# Altium project Drone Flight Controller.PrjPcb
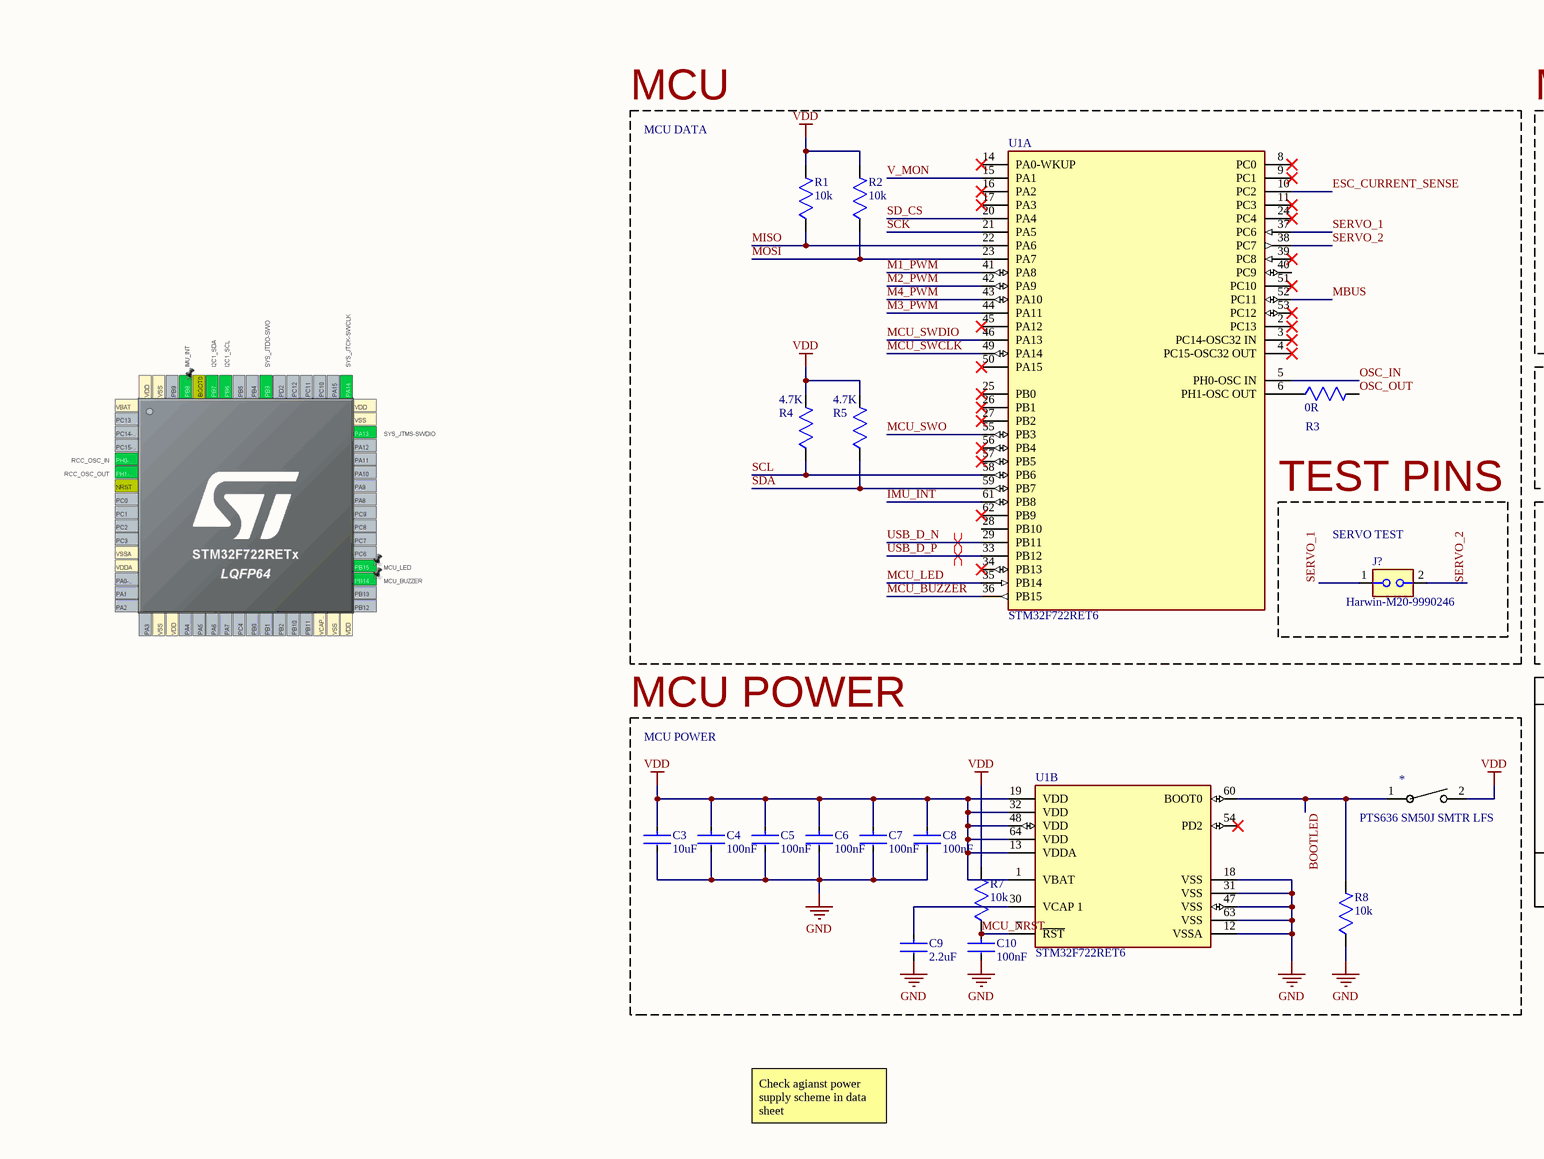
[diagram p0: MCU.SchDoc, left]
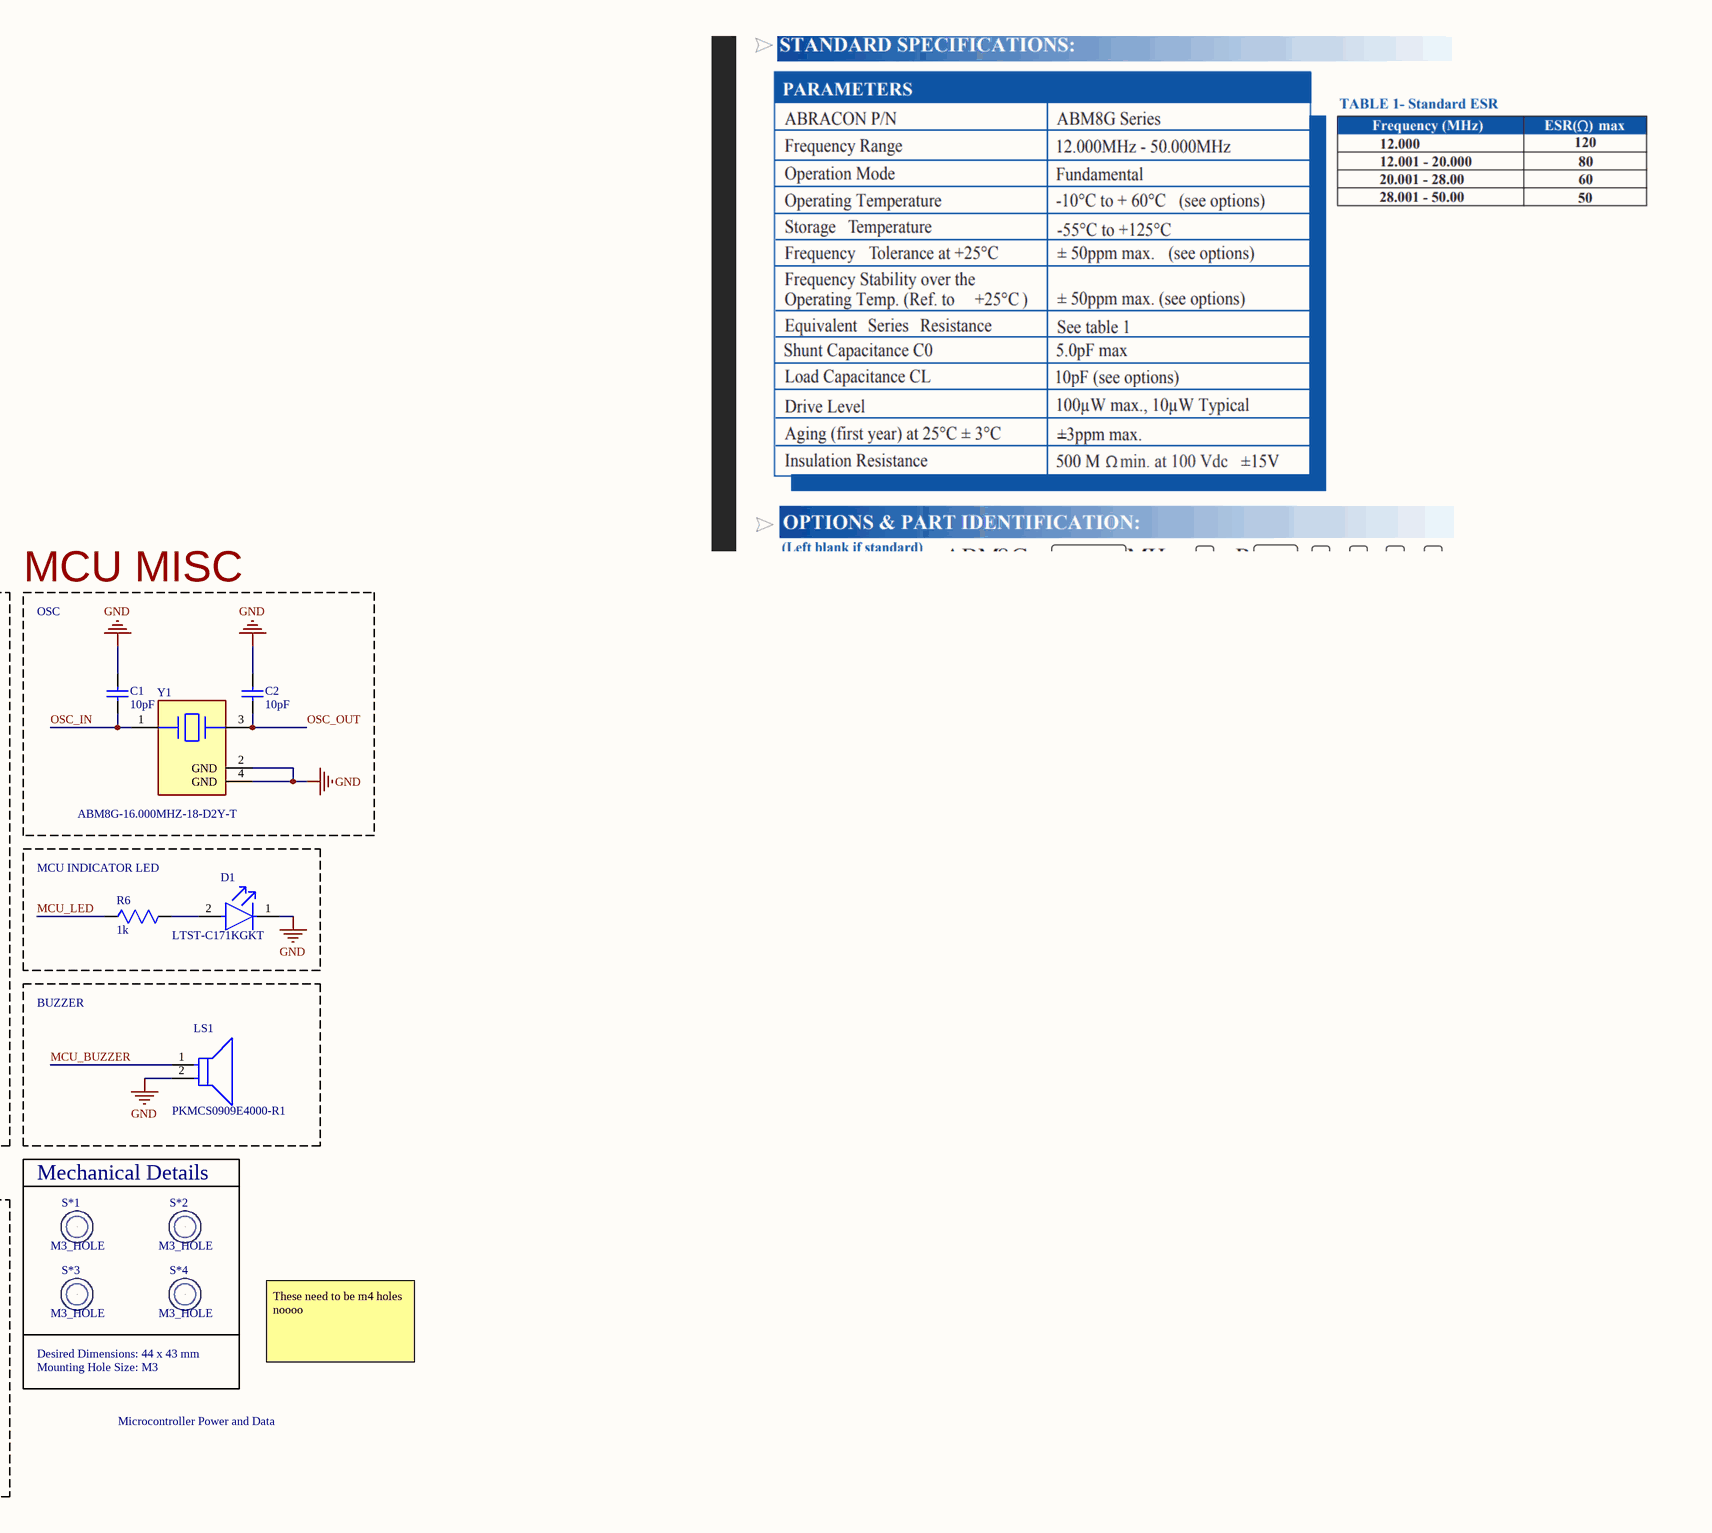
[diagram p1: MCU.SchDoc, right]
4 sheets, 63 parts. Net scope: global (net labels, ports and power ports of the same name join across sheets).
Board files: PCB1.PcbDoc, PCB Rev 2.PcbDoc
Sheets:
  MCU.SchDoc
  Sensors.SchDoc
  Power.SchDoc
  Connectors.SchDoc

## Sheet MCU.SchDoc
size A4; SheetNumber: 1; SheetTotal: 4

### Parts
*1  PTS636 SM50J SMTR LFS  [PTS636 SM50J SMTR LFS-Footprint-1]
C1  10pF  [CAPC1005X55X25ML05T05]
C2  10pF  [CAPC1005X55X25ML05T05]
C3  10uF  [CAP_1210]
C4  100nF  [CAP_0603]
C5  100nF  [CAP_0603]
C6  100nF  [CAP_0603]
C7  100nF  [CAP_0603]
C8  100nF  [CAP_0603]
C9  2.2uF  [CAP_1210]
C10  100nF  [CAP_0603]
D1  LTST-C171KGKT  [FP-LTST-C171KGKT-MFG]
J?5  Harwin-M20-9990246  [HARWIN_M20-9990246]
LS1  PKMCS0909E4000-R1  [FP-PKMCS-MFG]
R1  10k  [RES_0603]
R2  10k  [RES_0603]
R3  0R  [RES_0603]
R4  4.7K  [RES_0603]
R5  4.7K  [RES_0603]
R6  1k  [RES_0603]
R7  10k  [RES_0603]
R8  10k  [RES_0603]
S*1  M3_HOLE  [M3 Screw Hole Footprint]
S*2  M3_HOLE  [M3 Screw Hole Footprint]
S*3  M3_HOLE  [M3 Screw Hole Footprint]
S*4  M3_HOLE  [M3 Screw Hole Footprint]
U1  STM32F722RET6  [FP-LQFP64-5W-IPC_A]  (parts A,B of 2)
Y1  ABM8G-16.000MHZ-18-D2Y-T  [FP-ABM8G-MFG]

### Blocks framed on the sheet
MCU: R1-R5 U1
MCU MISC: C1 C2 Y1
MCU INDICATOR LED: D1 R6
TEST PINS: J?5
BUZZER: LS1
MCU POWER: *1 C3-C10 R7 R8 U1

### Nets
GND: C1.2 C2.2 C3.2 C4.2 C5.2 C6.2 C7.2 C8.2 C9.2 C10.2 D1.1(C) LS1.2(A) R8.1 U1.12(VSSA) U1.18(VSS) U1.31(VSS) U1.47(VSS) U1.63(VSS) Y1.2(GND) Y1.4(GND)
SCL: R4.1 U1.58(PB6)
SDA: R5.1 U1.59(PB7)
VDD: *1.2 C3.1 C4.1 C5.1 C6.1 C7.1 C8.1 R1.2 R2.2 R4.2 R5.2 R7.2 U1.1(VBAT) U1.13(VDDA) U1.19(VDD) U1.32(VDD) U1.48(VDD) U1.64(VDD)
BOOTLED: *1.1 R8.2 U1.60(BOOT0)
ESC_CURRENT_SENSE: U1.10(PC2)
IMU_INT: U1.61(PB8)
M1_PWM: U1.41(PA8)
M2_PWM: U1.42(PA9)
M3_PWM: U1.44(PA11)
M4_PWM: U1.43(PA10)
MBUS: U1.52(PC11)
MCU_BUZZER: LS1.1(C) U1.36(PB15)
MCU_LED: R6.1 U1.35(PB14)
MCU_NRST: C10.1 R7.1 U1.7(~{RST})
MCU_SWCLK: U1.49(PA14)
MCU_SWDIO: U1.46(PA13)
MCU_SWO: U1.55(PB3)
MISO: R1.1 U1.22(PA6)
MOSI: R2.1 U1.23(PA7)
OSC_IN: C1.1 U1.5(PH0-OSC_IN) Y1.1
OSC_OUT: C2.1 R3.2 Y1.3
SCK: U1.21(PA5)
SD_CS: U1.20(PA4)
SERVO_1: J?5.1 U1.37(PC6)
SERVO_2: J?5.2 U1.38(PC7)
USB_D_N: U1.29(PB11)
USB_D_P: U1.33(PB12)
V_MON: U1.15(PA1)
NetC9_1: C9.1 U1.30(VCAP_1)
NetD1_2: D1.2(A) R6.2
NetR3_1: R3.1 U1.6(PH1-OSC_OUT)

Not connected (* = marked no-connect by the designer): S*1 0; S*2 0; S*3 0; S*4 0; U1 2(PC13)* 3(PC14-OSC32_IN)* 4(PC15-OSC32_OUT)* 8(PC0)* 9(PC1)* 11(PC3)* 14(PA0-WKUP)* 16(PA2)* 17(PA3)* 24(PC4)* 25(PB0)* 26(PB1)* 27(PB2)* 28(PB10) 34(PB13)* 39(PC8)* 40(PC9) 45(PA12)* 50(PA15)* 51(PC10)* 53(PC12)* 54(PD2)* 56(PB4)* 57(PB5)* 62(PB9)*

### Layout directives
differential pair: USB_D_N, USB_D_P

### Notes on the sheet
- MCU DATA
- OSC
- (near J?5) SERVO TEST
- MCU POWER
- Mechanical Details
- Desired Dimensions: 44 x 43 mm
- These need to be m4 holes noooo
- Mounting Hole Size: M3
- Microcontroller Power and Data
- Check agianst power supply scheme in data sheet

### Library data of the parts
*1 = CMP-00098-1: Switch Tactile N.O. SPST Rectangular Button J-Bend 0.05A 12VDC 1.77N SMD T/R; Number of Positions: 1; Operating Force: 2.26N; Electrical Life: 50kcycles; Max Voltage Rating (DC): 12V; Max Current Rating: 50mA; Insulation Resistance: 100MΩ; Sealable: IP40; Length: 6mm; Lifecycle Status: Production; Throw Configuration: SPST; Min Operating Temperature: -40°C; Max Operating Temperature: 90°C; RoHS: Compliant; Height: 3.25mm; REACH SVHC: Yes; Contact Resistance: 100mΩ; Color: Black
C1 C2 = CMP-2100-03589-1: Chip Capacitor, 10 pF, +/- 5%, 50 V, -55 to 125 degC, 0402 (1005 Metric), RoHS, Tape and Reel; Manufacturer: Yageo; Insulation Resistance: 100GR; Voltage Rating (DC): 50V; Dielectric Material: Ceramic; Temperature Coefficient: 30ppm/degC; Dielectric: C0G; Termination: SMD/SMT; Package Reference: 0402; Lead Free: LeadFree; Composition: Ceramic; Tolerance: 5%; Case Code (Metric): 1005; Voltage Rating: 50V; Packaging: TapeandReel; Manufacturer URL: http://www.yageo.com/; REACH SVHC: NoSVHC; Max Operating Temperature: 125degC; Length: 1mm; Mount: SurfaceMount; Depth: 0.5mm; Min Operating Temperature: -55degC; Number of Pins: 2; Width: 0.02inch; Datasheet Version: Rev. 14, 07/2016; Package Quantity: 1; Datasheet URL: http://www.yageo.com/documents/recent/UPY-GP_NP0_16V-to-50V_14.pdf; Case Code (Imperial): 0402; RoHSCompliant: True; Radiation Hardening: No; Height: 0.5mm; Case/Package: 0402; Thickness: 0.022inch; Capacitance: 10pF; Package Description: 2-Pin Surface Mount Device, Body 1 x 0.5 mm; Voltage: 50V
C3 = CMP-097-000018-7: 10 µF ±10% 100V Ceramic Capacitor X7S 1210 (3225 Metric); JLCPCB Part No.: C5596909
C4-C8 C10 = CMP-097-000004-12: CAP CER 0.1UF 50V X7R 0603; Tolerance (fill in as +-): 10%; Capacitor Type: Ceramic; Multilayer: Yes; Width: 0.8mm; Pins: 2; Case/Package: 0603; Max Operating Temperature: 125°C; Value: 100nF; Package Style: SMTMeter; Terminal Finish: Nickel; RoHS Compliant: Yes; Height: 0.8mm; Reach SVHC Compliant: Yes; JLCPCB Part No.: C14663; Tolerance  (fill in as +-): 10%; Temperature Characteristics Code: X7R; Rated DC Voltage (URdc): 50V; JESD-609 Code: e3; Termination: Wraparound; Dielectric Material: Ceramic; Length: 1.6mm; Package Shape: Rectangular; Min Operating Temperature: -55°C; Packaging: Tape and Reel; Mounting Technology: Surface Mount
C9 = CMP-097-000020-5: 2.2 µF ±10% 100V Ceramic Capacitor X7R 1210 (3225 Metric); JLCPCB Part No.: C55151; Value: 2.2uF
D1 = CMP-22017-000037-1: LED GREEN CLEAR SMD; Number of LEDs: 1; Viewing Angle: 130°; Lens Style: Rectangular; Dominant Wavelength: 571nm; Test Current: 20mA; Luminous Intensity: 35mcd; Power Rating: 75mW; Forward Voltage: 2.4V; Forward Current: 30mA; Reverse Voltage: 5V; Lens Color: Colorless; Wavelength: 574nm; Height: 0.8mm; Illumination Color: Green; Length: 2mm; Case/Package: 0805; Number of Pins: 2; Number of Elements: 1; Package Quantity: 1; Depth: 1.25mm; Lens Transparency: Clear; Width: 1.25mm; Color: Green; Radiation Hardening: No; Mount: Surface Mount; Packaging: Tape and Reel; Case Code (Metric): 2012; Lead Free: Lead Free; Max Operating Temperature: 85°C; Min Operating Temperature: -55°C; Case Code (Imperial): 0805; Power Dissipation: 75mW
J?5 = CMP-00000-10: Connector Header Through Hole 2 position 0.100" (2.54mm); Number of Positions: 2; Contact Resistance: 30mR; Voltage Rating (AC): 750V; Max Current Rating: 3A; Insulation Resistance: 10GR; Gender: Male; Case/Package: SIL; Termination: Solder; Mount: Through Hole; Housing Material: Nylon; Max Operating Temperature: 105°C; JLCPCB Part No.: C3332353; Orientation: Straight; Contact Material: Bronze,Brass; Depth: 2.54mm; Current Rating: 3A; Radiation Hardening: No; Pitch: 2.54mm; Reach SVHC Compliant: No; Length: 5.08mm; Number of Rows: 1; Series: M20; Packaging: Bulk; Contact Plating: Tin; Contact Type: Male Pin; Color: Black; Contact Mating Length: 0.24inch; Package Quantity: 1000; Housing Color: Black; Min Operating Temperature: -40°C; Number of Contacts: 2
LS1 = CMP-2000-05252-2: AUDIO PIEZO TRANSDUCER 12.5V SMD; Min Supply Voltage (DC): -12.5V; Self Resonant Frequency: 4kHz; Voltage Rating: 1.5V; Height: 1.9mm; Packaging: Tape and Reel; Min Operating Temperature: -40°C; Width: 9mm; Lead Free: Lead Free; Max Operating Temperature: 85°C; Max Supply Voltage (DC): 12.5V; Termination: Solder; Depth: 9mm; REACH SVHC: No SVHC; Frequency: 4kHz; Voltage Rating (DC): 12.5V; Radiation Hardening: No; Package Quantity: 2000; Length: 9mm; Mount: Surface Mount
R1 R2 R7 R8 = CMP-00013-14: 10 kOhms ±1% 0.1W, 1/10W Chip Resistor 0603 (1608 Metric) Moisture Resistant Thick Film; Package Height: 0.45mm; Rated Temperature: 70°C; Temperature Coefficient: 100ppm/°C; Value: 10kR; Additional Feature: LASER TRIMMABLE; Power: 100mW; Working Voltage: 75V; Package Width: 0.8mm; Package Length: 1.6mm; Technology: METAL GLAZE/THICK FILM; Package Style: SMTMeter; Mounting Technology: Surface Mount; Reach SVHC Compliant: Yes; Package Shape: Rectangular; Min Operating Temperature: -55°C; Construction: Chip; JESD-609 Code: e3; Packaging: Tape and Reel; Tolerance: 1%; Max Operating Temperature: 155°C; Case/Package: 0603; Termination: Wraparound; Resistor Type: FIXED RESISTOR; Terminal Finish: Nickel; Pins: 2; JLCPCB Part No.: C98220; RoHS Compliant: Yes
R3 = CMP-027-000028-7: 0 Ohms Jumper Chip Resistor 0603 (1608 Metric) Moisture Resistant Thick Film; Package Length: 1.6mm; Package Height: 0.45mm; Power: 100mW; Package Width: 0.8mm; Rated Temperature: 70°C; JLCPCB Part No.: C95177; RoHS Compliant: Yes; Packaging: Tape and Reel; Technology: METAL GLAZE/THICK FILM; Max Operating Temperature: 155°C; Pins: 2; Reach SVHC Compliant: Yes; Value: 0R; Package Shape: Rectangular; Min Operating Temperature: -55°C; Terminal Finish: Nickel; Termination: Wraparound; Resistor Type: FIXED RESISTOR; Mounting Technology: Surface Mount; Construction: Chip; Case/Package: 0603; JESD-609 Code: e3
R4 R5 = CMP-00062-2: Res Thick Film 1.6 x 0.8 mm 4.7K Ohm 1% 0.1W(1/10W) 100ppm/ C Molded SMD Paper T/R; JLCPCB Part No.: C99782
R6 = CMP-019-000000-15: 1 kOhms ±1% 0.1W, 1/10W Chip Resistor 0603 (1608 Metric) Moisture Resistant Thick Film; Rated Temperature: 70°C; Working Voltage: 75V; Package Height: 0.45mm; MP: RC0805FR-071KL; Package Length: 1.6mm; Additional Feature: LASER TRIMMABLE; Temperature Coefficient: 100ppm/°C; Power: 100mW; MF: Yageo; Value: 1kR; Package Width: 0.8mm; Availability: In Stock; Package Style: SMTMeter; Termination: Wraparound; Min Operating Temperature: -55°C; SnapEDA_Link: https://www.snapeda.com/parts/RC0805FR-071KL/Yageo/view-part/?ref=snap; Mounting Technology: Surface Mount; Package: 2012 Rohm Semiconductor; JESD-609 Code: e3; Resistor Type: FIXED RESISTOR; Tolerance: 1%; RoHS Compliant: Yes; Case/Package: 0603; Package Shape: Rectangular; Component Type: Standard; Check_prices: https://www.snapeda.com/parts/RC0805FR-071KL/Yageo/view-part/?ref=eda; Pins: 2; Source: RC0805FR-071KL.SchLib; JLCPCB Part No.: C22548; Max Operating Temperature: 155°C; Pin Count: 2; Construction: Chip; Purchase-URL: https://pricing.snapeda.com/search/part/RC0805FR-071KL/?ref=eda; Terminal Finish: Nickel; Technology: METAL GLAZE/THICK FILM; Price: None; Reach SVHC Compliant: Yes; Design Item ID: RC0805FR-071KL; Packaging: Tape and Reel
S*1-S*4 = CMP-00045-5: Standard sized M3 screw mounting hole
U1 = CMP-12105-000139-1: IC MCU 32BIT 512KB FLASH 64LQFP; Interface: I2C; Number of I/Os: 50; Peripherals: Brown-out Detect/Reset; Core Architecture: ARM; Oscillator Type: Internal; Frequency: 216MHz; Memory Size: 512KB; Min Operating Temperature: -40°C; Max Operating Temperature: 85°C; Mount: Surface Mount; Case/Package: LQFP; Memory Type: FLASH; Packaging: Tray
Y1 = CMP-27762-006537-2: Crystal 16MHz ±20ppm (Tol) ±30ppm (Stability) 18pF FUND 80Ω 4-Pin SMD T/R; Series Resistance: 80R; Radiation Hardening: No; Load Capacitance: 18pF; Package Quantity: 1000; Frequency Stability: 30ppm; ESR (Equivalent Series Resistance): 80R; Depth: 2.5mm; Height: 1mm; Number of Pins: 4; Frequency Tolerance: 20ppm; Frequency: 16MHz; Tolerance: 20ppm; Min Operating Temperature: -40°C; Length: 3.2mm; Termination: SMD/SMT; Max Operating Temperature: 85°C; Width: 2.5mm; Series: ABM8G; Mount: Surface Mount; Case/Package: CSMD; Lead Free: Lead Free; Operating Frequency: 16 MHz; Packaging: Tape and Reel

## Sheet Sensors.SchDoc
size A4; SheetNumber: 2; SheetTotal: 4
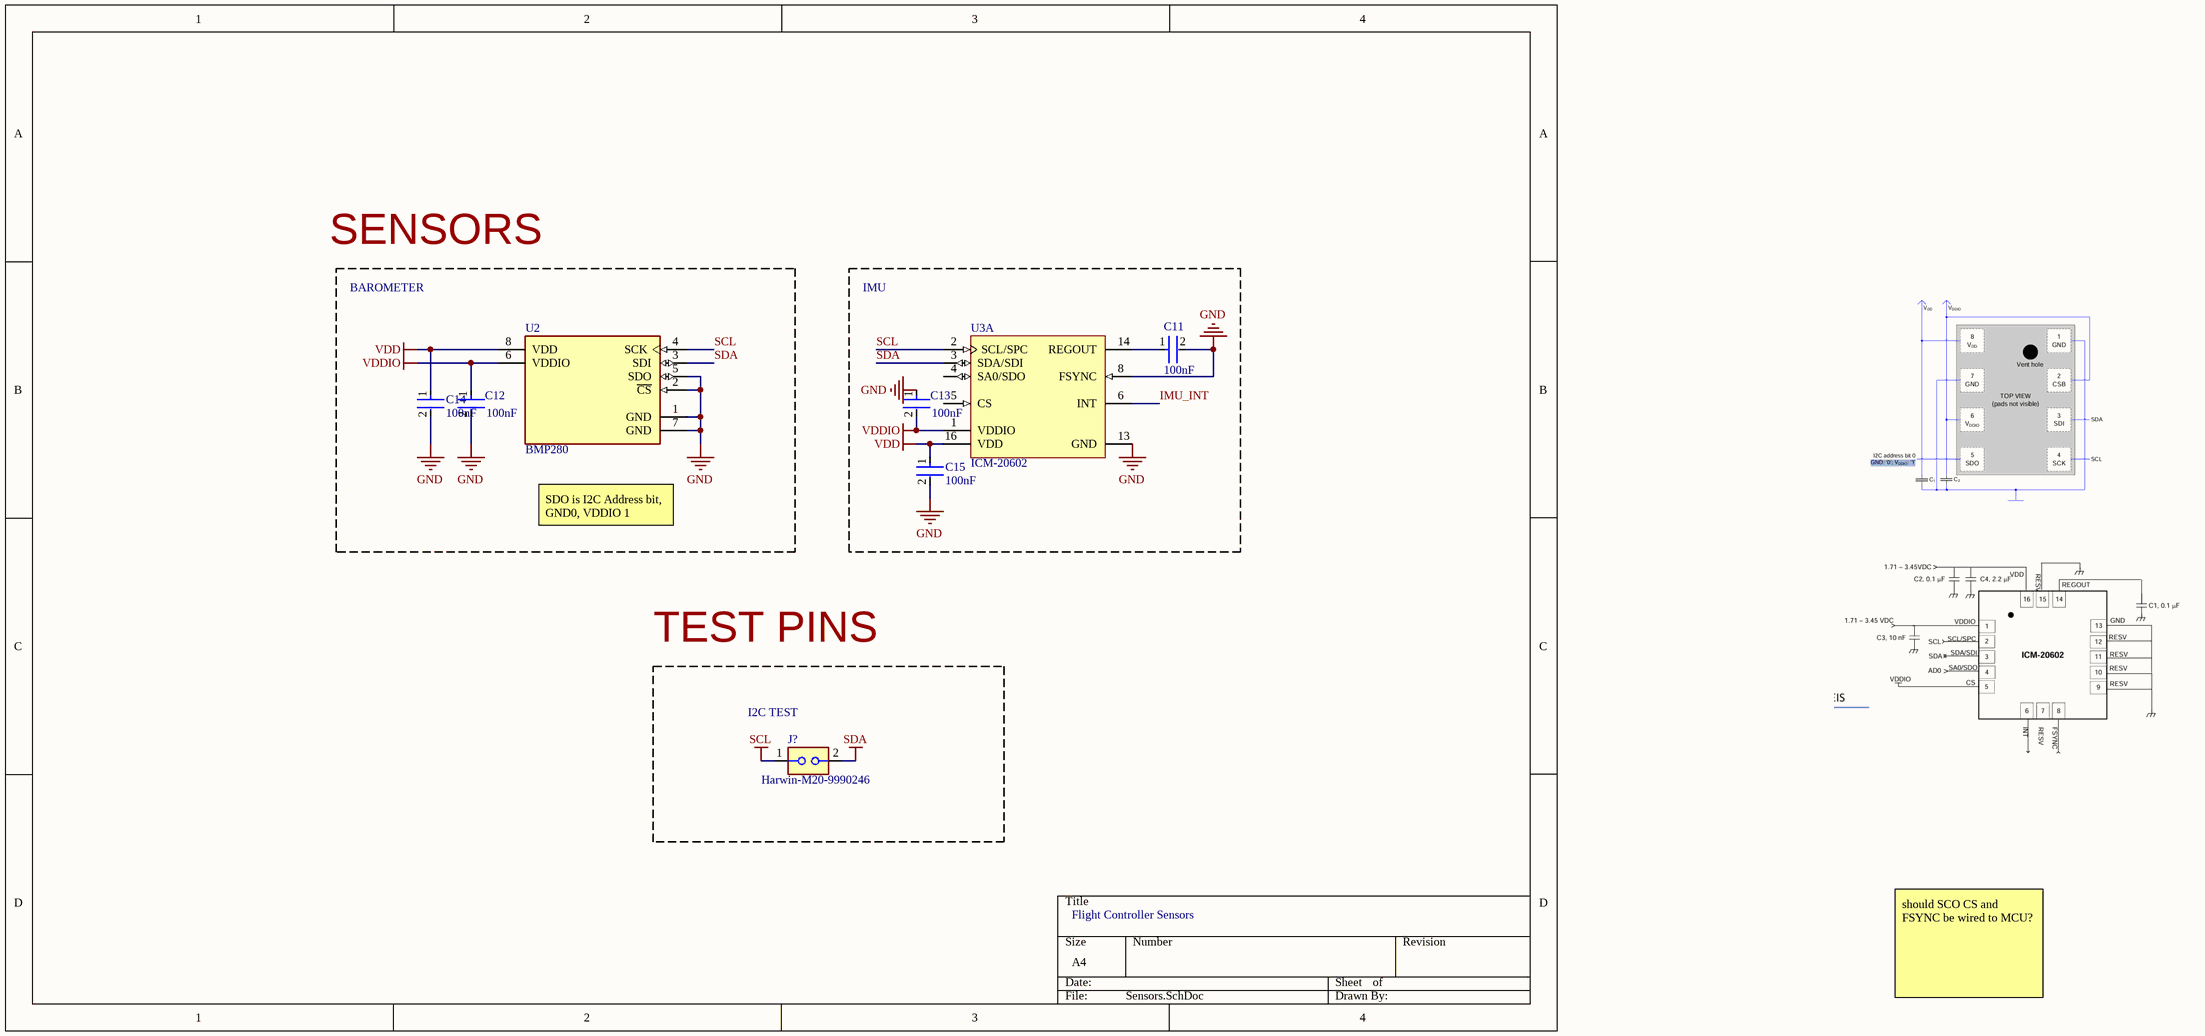
[diagram p2: Sensors.SchDoc]

### Parts
C11  100nF  [FP-CL93-IPC_C]
C12  100nF  [FP-CL93-IPC_C]
C13  100nF  [FP-CL93-IPC_C]
C14  100nF  [FP-CL93-IPC_C]
C15  100nF  [FP-CL93-IPC_C]
J?3  Harwin-M20-9990246  [HARWIN_M20-9990246]
U2  BMP280  [FP-BMP280-MFG]
U3  ICM-20602  [INSE-I62-16]  (part A of 2)

### Blocks framed on the sheet
BAROMETER: C12 C14 U2
IMU: C11 C13 C15 U3
TEST PINS: J?3

### Nets
GND: C11.2 C12.2 C13.1 C14.2 C15.2 U2.1(GND) U2.2(~{CS}) U2.5(SDO) U2.7(GND) U3.8(FSYNC) U3.13(GND)
SCL: J?3.1 U2.4(SCK) U3.2(SCL/SPC)
SDA: J?3.2 U2.3(SDI) U3.3(SDA/SDI)
VDD: C14.1 C15.1 U2.8(VDD) U3.16(VDD)
VDDIO: C12.1 C13.2 U2.6(VDDIO) U3.1(VDDIO)
IMU_INT: U3.6(INT)
NetC11_1: C11.1 U3.14(REGOUT)

Not connected (* = marked no-connect by the designer): U3 4(SA0/SDO) 5(CS)

### Notes on the sheet
- SENSORS
- SDO is I2C Address bit, GND0, VDDIO 1
- (near J?3) I2C TEST
- Flight Controller Sensors
- should SCO CS and FSYNC be wired to MCU?

### Library data of the parts
C11-C15 = CMP-13271-000610-1: Cap Ceramic 100nF 10V X7R ±10% SMD 0402 +125°C Paper T/R
J?3 = CMP-00000-10: as J?5 on sheet MCU; Case/Package: SIL; Termination: Solder; Mount: Through Hole; Housing Material: Nylon; Max Operating Temperature: 105°C; JLCPCB Part No.: C3332353; Orientation: Straight; Contact Material: Bronze,Brass; Depth: 2.54mm; Current Rating: 3A; Radiation Hardening: No; Pitch: 2.54mm; Reach SVHC Compliant: No; Length: 5.08mm; Number of Rows: 1; Series: M20; Packaging: Bulk; Contact Plating: Tin; Contact Type: Male Pin; Color: Black; Contact Mating Length: 0.24inch; Package Quantity: 1000; Housing Color: Black; Min Operating Temperature: -40°C; Number of Contacts: 2
U2 = CMP-2000-05076-3: SENSOR PRESSURE ABS; Operating Pressure: 15.95PSI; Pressure Type: Absolute; Output Type: SPI; Max Pressure: 290.08PSI; Port Style: No Port; Case/Package: SMD/SMT; Lead Free: Lead Free; Termination: SMD/SMT; Min Operating Temperature: -40°C; Number of Pins: 8; Max Operating Temperature: 85°C
U3 = CMP-2000-07589-1: High Performance 6-Axis MEMS MotionTracking(TM) Device, 1.71 to 3.45 V, -40 to 85 degC, 16-Pin LGA, RoHS; Manufacturer: InvenSense; Sensor Type: Temperature; Output Type: I2C; RoHSCompliant: True; Datasheet Version: Rev. 1.0, 10/2016; Datasheet URL: http://www.invensense.com/wp-content/uploads/2016/10/DS-000176-ICM-20602-v1.0.pdf; Min Operating Temperature: -40degC; Mounting Technology: SurfaceMount; Max Operating Temperature: 85degC; Manufacturer URL: http://www.invensense.com/; Package Reference: I62-16; Package Description: 16-Pin Land Grid Array, Body 3 x 3 mm, Pitch 0.5 mm

## Sheet Power.SchDoc
size A4; SheetNumber: 3; SheetTotal: 4
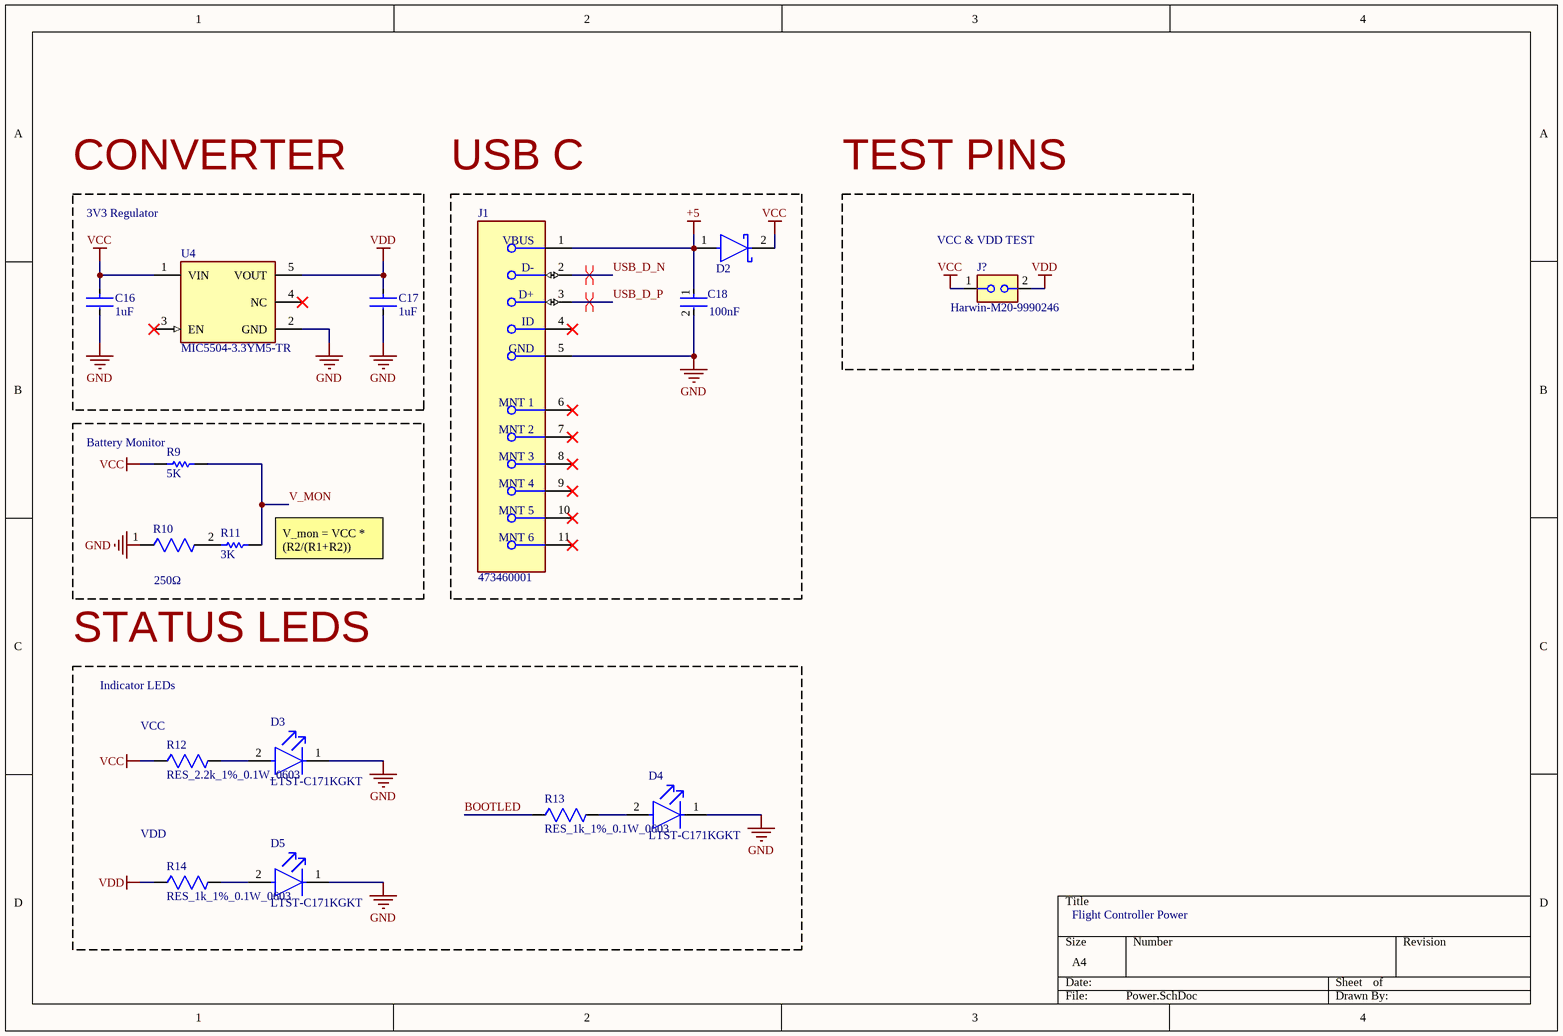
[diagram p3: Power.SchDoc]

### Parts
C16  1uF  [CAP_0603]
C17  1uF  [CAP_0603]
C18  100nF  [FP-CL93-IPC_C]
D2  SCHOTTKY_40Vrm_1A_500mV  [FP-403AE-MFG]  (value not drawn)
D3  LTST-C171KGKT  [FP-LTST-C171KGKT-MFG]
D4  LTST-C171KGKT  [FP-LTST-C171KGKT-MFG]
D5  LTST-C171KGKT  [FP-LTST-C171KGKT-MFG]
J1  473460001  [FP-473460001-MFG]
J?2  Harwin-M20-9990246  [HARWIN_M20-9990246]
R9  5K  [RESC2013X83X38NL15T13]
R10  (no value)  [RNCF0603_MFG]
R11  3K  [RESC3116X65X40ML10T20]
R12  RES_2.2k_1%_0.1W_0603  [RES_0603]
R13  RES_1k_1%_0.1W_0603  [RES_0603]
R14  RES_1k_1%_0.1W_0603  [RES_0603]
U4  MIC5504-3.3YM5-TR  [FP-SOT23-5LD-PL-1-MFG]

### Blocks framed on the sheet
CONVERTER: C16 C17 U4
USB C: C18 D2 J1
TEST PINS: J?2
Battery Monitor: R9-R11
STATUS LEDS: D3-D5 R12-R14

### Nets
+5: C18.1 D2.1(A) J1.1(VBUS)
GND: C16.2 C17.2 C18.2 D3.1(C) D4.1(C) D5.1(C) J1.5(GND) R10.1 U4.2(GND)
VCC: C16.1 D2.2(C) J?2.1 R9.1 R12.1 U4.1(VIN)
VDD: C17.1 J?2.2 R14.1 U4.5(VOUT)
BOOTLED: R13.1
USB_D_N: J1.2(D-)
USB_D_P: J1.3(D+)
V_MON: R9.2 R11.2
NetD3_2: D3.2(A) R12.2
NetD4_2: D4.2(A) R13.2
NetD5_2: D5.2(A) R14.2
NetR10_2: R10.2 R11.1

Not connected (* = marked no-connect by the designer): J1 4(ID)* 6(MNT_1)* 7(MNT_2)* 8(MNT_3)* 9(MNT_4)* 10(MNT_5)* 11(MNT_6)*; U4 3(EN)* 4(NC)*

### Layout directives
differential pair: USB_D_N, USB_D_P

### Notes on the sheet
- 3V3 Regulator
- (near J?2) VCC & VDD TEST
- (near R11) V_mon = VCC * (R2/(R1+R2))
- Indicator LEDs
- (near R12) VCC
- (near R14) VDD
- Flight Controller Power

### Library data of the parts
C16 C17 = CMP-097-000006-8: CAP CER 1UF 50V X5R 0603; Tolerance  (fill in as +-): 10%; Multilayer: Yes; Dielectric Material: Ceramic; Mounting Technology: Surface Mount; Max Operating Temperature: 85°C; Value: 1uF; Package Style: SMTMeter; Termination: Wraparound; JESD-609 Code: e3; Temperature Characteristics Code: X5R; Rated DC Voltage (URdc): 50V; Packaging: Tape and Reel; Tolerance (fill in as +-): 10%; Case/Package: 0603; JLCPCB Part No.: C15849; Height: 0.9mm; Package Shape: Rectangular; Terminal Finish: Nickel; Capacitor Type: Ceramic; Reach SVHC Compliant: Yes; Width: 0.8mm; Length: 1.6mm; Min Operating Temperature: -55°C; Pins: 2; RoHS Compliant: Yes
C18 = CMP-13271-000610-1: as C11 on sheet Sensors
D2 = CMP-00074-2: SS14 Series 500 mV 1 A 40 V Max Reverse Voltage Schottky Rectifier - DO-214AC; JLCPCB Part No.: C2480
D3-D5 = CMP-22017-000037-1: as D1 on sheet MCU; Height: 0.8mm; Illumination Color: Green; Length: 2mm; Case/Package: 0805; Number of Pins: 2; Number of Elements: 1; Package Quantity: 1; Depth: 1.25mm; Lens Transparency: Clear; Width: 1.25mm; Color: Green; Radiation Hardening: No; Mount: Surface Mount; Packaging: Tape and Reel; Case Code (Metric): 2012; Lead Free: Lead Free; Max Operating Temperature: 85°C; Min Operating Temperature: -55°C; Case Code (Imperial): 0805; Power Dissipation: 75mW
J1 = CMP-2000-05246-2: CONN RCPT USB2.0 MICRO B SMD R/A; Manufacturer: Molex; Conn Orientation: Right Angle; Is Female: yes; Shielding: true; Pitch: 0.65mm; Number Of Contacts: 5; Voltage Rating: 30V; Current Rating: 1.8A; Device Class L2: USB Connectors; Digikey Description: CONN RCPT USB2.0 MICRO B SMD R/A; Height: 2.945mm; RoHS: TRUE; ComponentLink2Description: Datasheet; Octopart: https://octopart.com/47346-0001-molex-7164928; Automotive: No; Package: 0; Category: Conn; Device Class L1: Connectors; Usb Standard: USB 2.0; Temperature: -30°C to +85°C; Temperature Range Low: -30°C; Footprint Url: https://www.molex.com/pdm_docs/sd/473460001_sd.pdf; ComponentLink2URL: https://www.molex.com/webdocs/datasheets/pdf/en-us/0473460001_IO_CONNECTORS.pdf; Lead Free: Yes; Manufacturer Part Number: 473460001; Contact Material: Gold,Nickel; Temperature Range High: +85°C; Device Class L3: unset
J?2 = CMP-00000-10: as J?5 on sheet MCU; Case/Package: SIL; Termination: Solder; Mount: Through Hole; Housing Material: Nylon; Max Operating Temperature: 105°C; JLCPCB Part No.: C3332353; Orientation: Straight; Contact Material: Bronze,Brass; Depth: 2.54mm; Current Rating: 3A; Radiation Hardening: No; Pitch: 2.54mm; Reach SVHC Compliant: No; Length: 5.08mm; Number of Rows: 1; Series: M20; Packaging: Bulk; Contact Plating: Tin; Contact Type: Male Pin; Color: Black; Contact Mating Length: 0.24inch; Package Quantity: 1000; Housing Color: Black; Min Operating Temperature: -40°C; Number of Contacts: 2
R9 = CMP-2001-04320-1: Manufacturer: Vishay Dale; Part Number: PNM0805E5001BST5
R10 = CMP-00347-47553138-1: Res Thin Film 0603 250 Ohm 0.01% 0.1W(1/10W) ±5ppm/°C Pad SMD T/R Automotive AEC-Q200; Power Rating: 63mW; Max Power Dissipation: 100mW; Resistance: 250Ω; Schedule B: 8533210045, 8533210045; Features: Moisture Resistant; Case Code (Imperial): 0603; Width: 787.4µm; Case/Package: 0603; Composition: Thin Film; ComponentLink2Description: Datasheet URL; HelpURL: https://www.seielect.com/catalog/sei-rncf.pdf; Number of Terminations: 2; Length: 1.6002mm; ComponentLink1Description: Manufacturer's Website; Temperature Coefficient: 5ppm/°C; Mount: Surface Mount; Tolerance: 0.01%; Case Code (Metric): 1608; Max Operating Temperature: 155°C; RoHS: Compliant; Height: 558.8µm; ComponentLink2URL: https://www.seielect.com/catalog/sei-rncf.pdf; Min Operating Temperature: -55°C; ComponentLink1URL: http://www.seielect.com
R11 = CMP-2003-03976-1: Part Number: RC1206JR-073KL; Manufacturer: Yageo
R12 = CMP-027-000005-7: 2.2 kOhms ±1% 0.1W, 1/10W Chip Resistor 0603 (1608 Metric) Moisture Resistant Thick Film; Value: 2.2kR; JLCPCB Part No.: C114662
R13 R14 = CMP-019-000000-15: as R6 on sheet MCU; Availability: In Stock; Package Style: SMTMeter; Termination: Wraparound; Min Operating Temperature: -55°C; SnapEDA_Link: https://www.snapeda.com/parts/RC0805FR-071KL/Yageo/view-part/?ref=snap; Mounting Technology: Surface Mount; Package: 2012 Rohm Semiconductor; JESD-609 Code: e3; Resistor Type: FIXED RESISTOR; Tolerance: 1%; RoHS Compliant: Yes; Case/Package: 0603; Package Shape: Rectangular; Component Type: Standard; Check_prices: https://www.snapeda.com/parts/RC0805FR-071KL/Yageo/view-part/?ref=eda; Pins: 2; Source: RC0805FR-071KL.SchLib; JLCPCB Part No.: C22548; Max Operating Temperature: 155°C; Pin Count: 2; Construction: Chip; Purchase-URL: https://pricing.snapeda.com/search/part/RC0805FR-071KL/?ref=eda; Terminal Finish: Nickel; Technology: METAL GLAZE/THICK FILM; Price: None; Reach SVHC Compliant: Yes; Design Item ID: RC0805FR-071KL; Packaging: Tape and Reel
U4 = CMP-2000-07604-2: IC REG LINEAR 3.3V 300MA SOT23-5; Quiescent Current: 38uA; Operating Supply Current: 42uA; Max Input Voltage: 5.5V; Min Input Voltage: 2.5V; Output Type: Fixed; Power Supply Rejection Ratio (PSRR): 60dB; Dropout Voltage: 380mV; Accuracy: 3%; Number of Outputs: 1; Nominal Output Voltage: 3.3V; Max Output Current: 300mA; Length: 2.9mm; Mount: Surface Mount; Width: 1.6mm; Packaging: Tape and Reel; Output Current: 300mA; Min Operating Temperature: -40°C; Max Operating Temperature: 125°C; Height: 1.1mm; Case/Package: SOT-23-5; REACH SVHC: No SVHC; Number of Pins: 5; Output Voltage: 3.3V

## Sheet Connectors.SchDoc
size A4; SheetNumber: 4; SheetTotal: 4
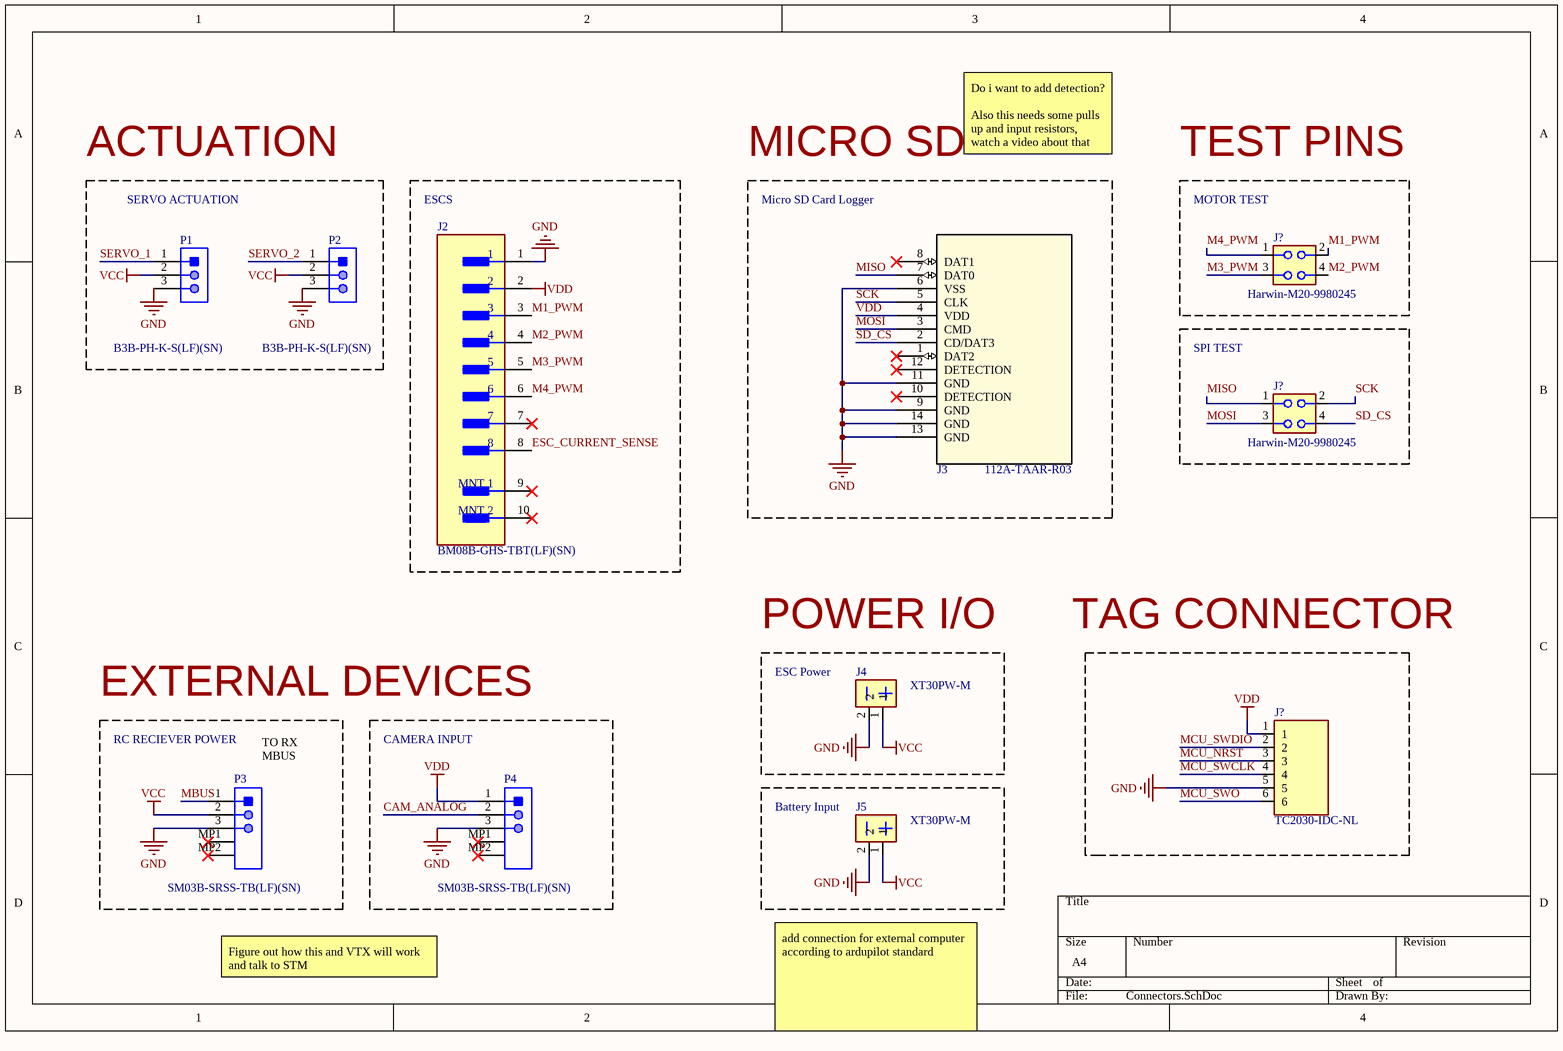
[diagram p4: Connectors.SchDoc]

### Parts
J2  BM08B-GHS-TBT(LF)(SN)  [FP-BM08B-GHS-TBT_LF_SN-MFG]
J3  112A-TAAR-R03  [CONN8_-TAAR-R03_ATT]
J4  XT30PW-M  [AMASS_XT30PW-M]
J5  XT30PW-M  [AMASS_XT30PW-M]
J?  TC2030-IDC-NL  [TAG_TC2030-IDC-NL]
J?1  Harwin-M20-9980245  [HARWIN_M20-9980245]
J?4  Harwin-M20-9980245  [HARWIN_M20-9980245]
P1  B3B-PH-K-S(LF)(SN)  [JST-B3B-PH-K-S-3_V]
P2  B3B-PH-K-S(LF)(SN)  [JST-B3B-PH-K-S-3_V]
P3  SM03B-SRSS-TB(LF)(SN)  [JST-SM03B-SRSS-TB_V]
P4  SM03B-SRSS-TB(LF)(SN)  [JST-SM03B-SRSS-TB_V]

### Blocks framed on the sheet
ACTUATION: P1 P2
ESCS: J2
MICRO SD: J3
TEST PINS: J?4
SPI TEST: J?1
POWER I/O: J4
EXTERNAL DEVICES: P3
CAMERA INPUT: P4
Battery Input: J5

### Nets
GND: J2.1 J3.6(VSS) J3.9(GND) J3.11(GND) J3.13(GND) J3.14(GND) J4.2 J5.2 J?.5 P1.3 P2.3 P3.3 P4.3
VCC: J4.1 J5.1 P1.2 P2.2 P3.2
VDD: J2.2 J3.4(VDD) J?.1 P4.1
CAM_ANALOG: P4.2
ESC_CURRENT_SENSE: J2.8
M1_PWM: J2.3 J?4.2
M2_PWM: J2.4 J?4.4
M3_PWM: J2.5 J?4.3
M4_PWM: J2.6 J?4.1
MBUS: P3.1
MCU_NRST: J?.3
MCU_SWCLK: J?.4
MCU_SWDIO: J?.2
MCU_SWO: J?.6
MISO: J3.7(DAT0) J?1.1
MOSI: J3.3(CMD) J?1.3
SCK: J3.5(CLK) J?1.2
SD_CS: J3.2(CD/DAT3) J?1.4
SERVO_1: P1.1
SERVO_2: P2.1

Not connected (* = marked no-connect by the designer): J2 7* 9(MNT_1)* 10(MNT_2)*; J3 1(DAT2)* 8(DAT1)* 10(DETECTION)* 12(DETECTION)*; P3 MP1* MP2*; P4 MP1* MP2*

### Notes on the sheet
- Do i want to add detection?
  Also this needs some pulls up and input resistors, watch a video about that
- SERVO ACTUATION
- Micro SD Card Logger
- (near J?4) MOTOR TEST
- TAG CONNECTOR
- (near J4) ESC Power
- RC RECIEVER POWER
- (near P3) TO RX MBUS
- Figure out how this and VTX will work and talk to STM
- add connection for external computer according to ardupilot standard

### Library data of the parts
J2 = CMP-17439-000100-2: CONN HEADER SMD 8POS 1.25MM; NexarPartId: 289283; Current Rating: 1A; Voltage Rating (AC): 50V; Number of Positions: 8; Wire/Cable Gauge: 26AWG; Contact Plating: Tin; Min Operating Temperature: -25°C; Contact Material: Copper, Tin; Packaging: Cut Tape; Max Operating Temperature: 85°C; Pitch: 1.25mm; Termination: SMD/SMT; REACH SVHC: No SVHC; Lead Free: Lead Free; Housing Material: Nylon; Height: 4.2mm; Case/Package: SMD/SMT; Lead Pitch: 1.25mm; Housing Color: Natural; Voltage Rating: 50V; RoHS: Compliant; Orientation: Straight; Number of Rows: 1; Number of Contacts: 8
J3 = CMP-255-000000-1: Manufacturer_Name: Attend; Copyright: Copyright (C) 2025 Ultra Librarian. All rights reserved.; Type: Type; Design Item ID: 112A-TAAR-R03; Source: 112A-TAAR-R03.SchLib; Manufacturer_Part_Number: 112A-TAAR-R03; RefDes: RefDes
J4 J5 = CMP-00055-6: Power Connector; MF: amass; MP: XT30UPB-M; Source: XT30UPB-M.SchLib; Value: *; Design Item ID: XT30UPB-M; Pin Count: 2; JLCPCB Part No.: C428721; Availability: Not in stock; Check_prices: https://www.snapeda.com/parts/XT30UPB-M/AMASS/view-part/?ref=eda; SnapEDA_Link: https://www.snapeda.com/parts/XT30UPB-M/AMASS/view-part/?ref=snap; Package: None; Price: None; Component Type: Standard
J? = CMP-257-000000-1: CABLE ADAPTER 6 POS; Source: M20-9980245.SchLib; JLCPCB Part No.: C6585845; DIN Conformance: No; IEC Conformance: No; Mounting Technology: Board; JESD-609 Code: e4; Contact Finish - Termination: Gold (Au); Component Type: Standard; Pin Count: 4; Price: None; Mounting Style: STRAIGHT; Contact Material: Brass; Termination: Solder; Contact Finish - Mating: GOLD; Contact Gender: Male; Design Item ID: M20-9980245; Availability: Unavailable; Filter Feature: No; Terminal Pitch: 2.54mm; Value: *; Flammability Rating: UL94 V-0; MP: M20-9980245; Package: None; RoHS Compliant: Yes; Reach SVHC Compliant: Yes; Mixed Contacts: No
J?1 J?4 = CMP-031-000001-6: Connector Header Through Hole 4 position 0.100" (2.54mm); MIL Conformance: No; Connector Type: BOARD CONNECTOR; Option: General Purpose; Number of Contacts: 4; Number of Rows Loaded: 1; Availability: Unavailable; Price: None; Design Item ID: TC2030-IDC-NL; Source: TC2030-IDC-NL.SchLib; Component Type: Standard; Value: *; Package: None; MP: TC2030-IDC-NL; Pin Count: 6
P1 P2 = CMP-2000-05164-1: Male Header, Pitch 2 mm, 1 x 3 Position, Height 6 mm, Tail Length 3.4 mm, -25 to 85 degC, RoHS, Bulk; Manufacturer: JST; Style/Orientation: StraightHeader/Plug; Pitch: 2mm; No of Positions: 3; Termination: Crimp; Manufacturer URL: http://www.jst.com/home2.html; Datasheet Version: Oct-06; Type: ShroudedHeader; Datasheet URL: https://datasheet.ciiva.com/11746/0900766b80826550-11746939.pdf
P3 P4 = CMP-2000-07077-1: Male Header, Pitch 1 mm, 1 x 3 Position, Height 2.9 mm, -25 to 85 degC, RoHS, Tape and Reel; Manufacturer: JST; Pitch: 1mm; Style/Orientation: RightAngleHeader/Plug; No of Positions: 3; Package Description: Male Header, Pitch 1 mm, 1 x 3 Position, Height 2.9 mm; Manufacturer URL: http://www.jst.com/home2.html; Package Reference: SM03B-SRSS-TB; Type: ShroudedHeader; Termination: Crimp; Mounting Technology: SurfaceMount; Datasheet Version: 11/2010; Datasheet URL: https://datasheet.ciiva.com/26894/getdatasheetpartid-708885-26894671.pdf

## Nets that join several sheets
GND: MCU (20 pins), Sensors (11 pins), Power (9 pins), Connectors (13 pins)
SCL: MCU (R4.1 U1.58), Sensors (J?3.1 U2.4 U3.2)
SDA: MCU (R5.1 U1.59), Sensors (J?3.2 U2.3 U3.3)
VCC: Power (6 pins), Connectors (5 pins)
VDD: MCU (18 pins), Sensors (C14.1 C15.1 U2.8 U3.16), Power (C17.1 J?2.2 R14.1 U4.5), Connectors (J2.2 J3.4 J?.1 P4.1)
BOOTLED: MCU (*1.1 R8.2 U1.60), Power (R13.1)
ESC_CURRENT_SENSE: MCU (U1.10), Connectors (J2.8)
IMU_INT: MCU (U1.61), Sensors (U3.6)
M1_PWM: MCU (U1.41), Connectors (J2.3 J?4.2)
M2_PWM: MCU (U1.42), Connectors (J2.4 J?4.4)
M3_PWM: MCU (U1.44), Connectors (J2.5 J?4.3)
M4_PWM: MCU (U1.43), Connectors (J2.6 J?4.1)
MBUS: MCU (U1.52), Connectors (P3.1)
MCU_NRST: MCU (C10.1 R7.1 U1.7), Connectors (J?.3)
MCU_SWCLK: MCU (U1.49), Connectors (J?.4)
MCU_SWDIO: MCU (U1.46), Connectors (J?.2)
MCU_SWO: MCU (U1.55), Connectors (J?.6)
MISO: MCU (R1.1 U1.22), Connectors (J3.7 J?1.1)
MOSI: MCU (R2.1 U1.23), Connectors (J3.3 J?1.3)
SCK: MCU (U1.21), Connectors (J3.5 J?1.2)
SD_CS: MCU (U1.20), Connectors (J3.2 J?1.4)
SERVO_1: MCU (J?5.1 U1.37), Connectors (P1.1)
SERVO_2: MCU (J?5.2 U1.38), Connectors (P2.1)
USB_D_N: MCU (U1.29), Power (J1.2)
USB_D_P: MCU (U1.33), Power (J1.3)
V_MON: MCU (U1.15), Power (R9.2 R11.2)